# EAGLE schematic Adapter_v1.0B (EAGLE 7.2.0)
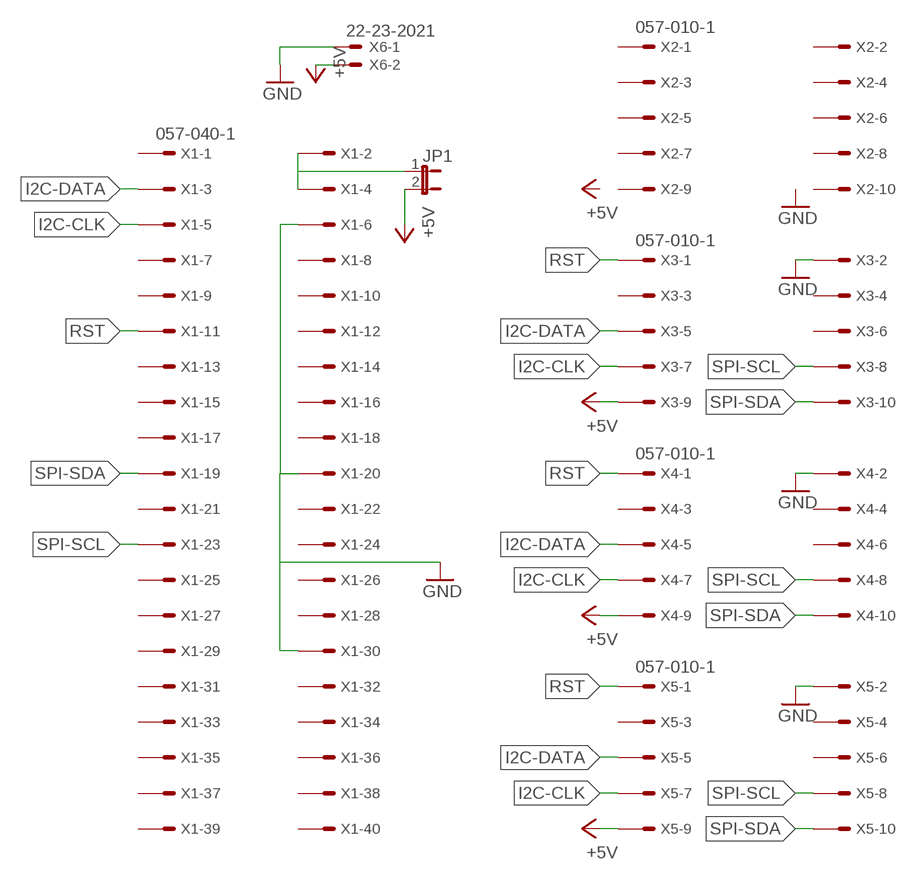
[diagram p0: schematic, sheet 1]

## Parts
JP1  JP1E  [JP1]
X1  057-040-1  [057-040-1]
X2  057-010-1  [057-010-1]
X3  057-010-1  [057-010-1]
X4  057-010-1  [057-010-1]
X5  057-010-1  [057-010-1]
X6  22-23-2021  [22-23-2021]

## Nets
+5V: JP1.2 X3.9 X4.9 X5.9 X6.2
GND: X1.6 X1.20 X1.30 X3.2 X4.2 X5.2 X6.1
I2C-CLK: X1.5 X3.7 X4.7 X5.7
I2C-DATA: X1.3 X3.5 X4.5 X5.5
N$1: JP1.1 X1.2 X1.4
RST: X1.11 X3.1 X4.1 X5.1
SPI-SCL: X1.23 X3.8 X4.8 X5.8
SPI-SDA: X1.19 X3.10 X4.10 X5.10
Unconnected: X1.1 X1.7 X1.8 X1.9 X1.10 X1.12 X1.13 X1.14 X1.15 X1.16 X1.17 X1.18 X1.21 X1.22 X1.24 X1.25 X1.26 X1.27 X1.28 X1.29 X1.31 X1.32 X1.33 X1.34 X1.35 X1.36 X1.37 X1.38 X1.39 X1.40 X2.1 X2.2 X2.3 X2.4 X2.5 X2.6 X2.7 X2.8 X2.9 X2.10 X3.3 X3.4 X3.6 X4.3 X4.4 X4.6 X5.3 X5.4 X5.6

## Library data of the parts
JP1 = jumper:JP1E: JUMPER
X1 = con-panduit:057-040-: CONNECTOR 40-pin series 057 contact pc board low profile headers; OC_FARNELL: unknown; OC_NEWARK: unknown
X2-X5 = con-panduit:057-010-: CONNECTOR 10-pin series 057 contact pc board low profile headers; OC_FARNELL: unknown; OC_NEWARK: unknown
X6 = con-molex:22-23-2021: .100" (2.54mm) Center Header - 2 Pin; MF: MOLEX; MPN: 22-23-2021; OC_FARNELL: 1462926; OC_NEWARK: 25C3832